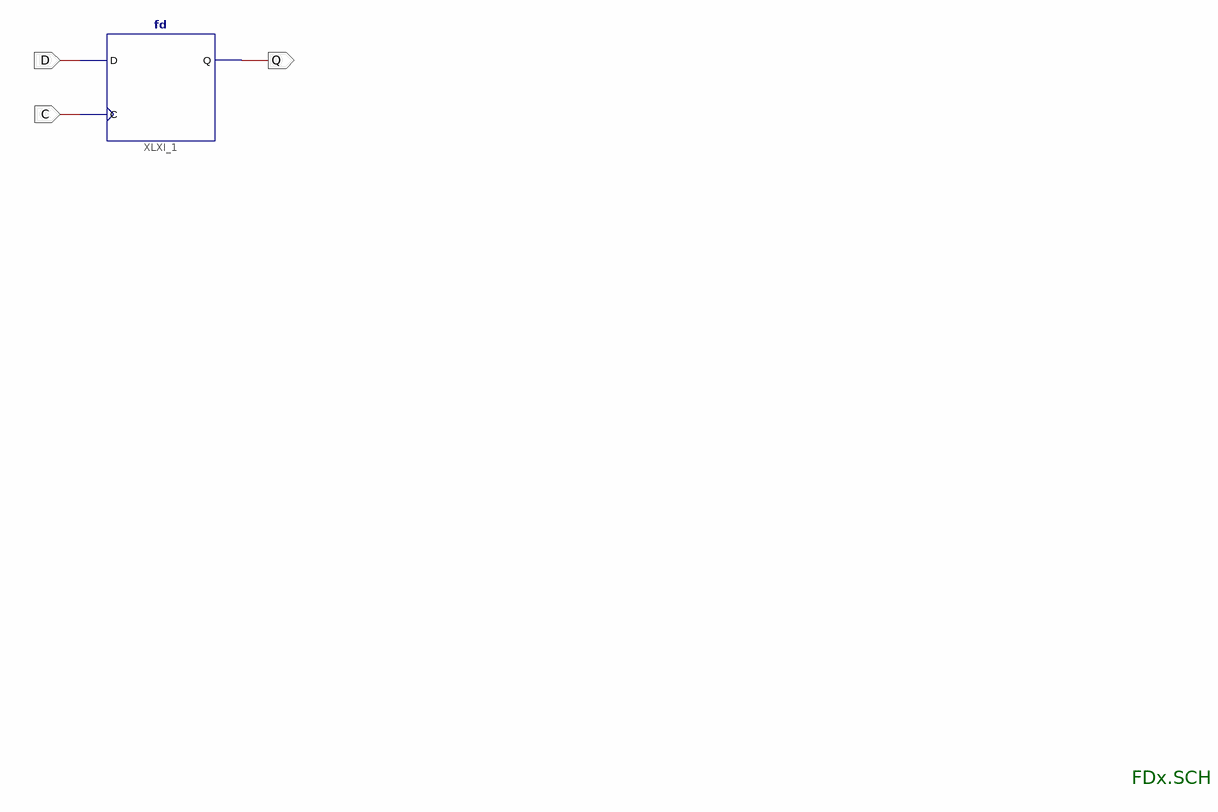
[diagram p0: schematic sheet 1]
// Xilinx ISE schematic FDx.sch (spartan3e) as structural Verilog: 1 symbols, 3 ports
module FDx (
  input  D,
  input  C,
  output Q
);

  fd XLXI_1 (.C(C), .D(D), .Q(Q));

  // Notes on the sheet:
  //   FDx.SCH
endmodule
